# EAGLE design Instrumentation_amplifier_CC3220SF (EAGLE 9.3.1)
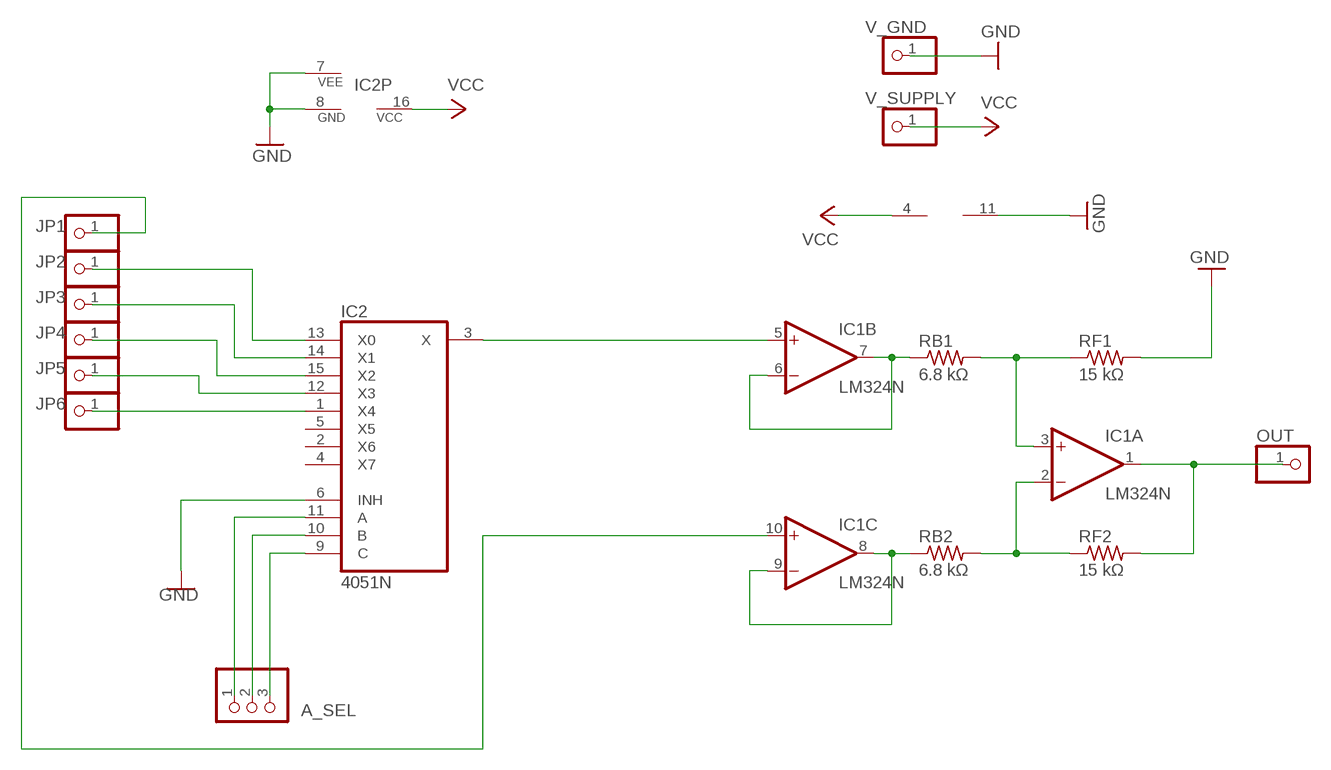
[diagram p0: schematic, sheet 1]

## Parts
A_SEL  PINHD-1X3  [1X03]
IC1  LM324N  [DIL14]
IC2  4051N  [DIL16]
JP1  PINHD-1X1  [1X01]
JP2  PINHD-1X1  [1X01]
JP3  PINHD-1X1  [1X01]
JP4  PINHD-1X1  [1X01]
JP5  PINHD-1X1  [1X01]
JP6  PINHD-1X1  [1X01]
OUT  PINHD-1X1  [1X01]
RB1  6.8 kΩ  R-US_0204/7  [0204/7]
RB2  6.8 kΩ  R-US_0204/7  [0204/7]
RF1  15 kΩ  R-US_0204/7  [0204/7]
RF2  15 kΩ  R-US_0204/7  [0204/7]
V_GND  PINHD-1X1  [1X01]
V_SUPPLY  PINHD-1X1  [1X01]

## Nets
GND: IC1.11(P:V-) IC2.6(INH) IC2.7(VEE) IC2.8(GND) RF1.2 V_GND.1
N$1: IC1.10(C:+IN) JP1.1
N$2: IC1.8(C:OUT) IC1.9(C:-IN) RB2.1
N$3: IC1.2(A:-IN) RB2.2 RF2.1
N$4: IC1.6(B:-IN) IC1.7(B:OUT) RB1.1
N$5: IC1.3(A:+IN) RB1.2 RF1.1
N$6: IC2.13(X0) JP2.1
N$7: IC1.5(B:+IN) IC2.3(X)
N$8: IC2.14(X1) JP3.1
N$9: IC2.15(X2) JP4.1
N$10: IC1.1(A:OUT) OUT.1 RF2.2
N$12: IC2.12(X3) JP5.1
N$13: IC2.1(X4) JP6.1
N$14: A_SEL.1 IC2.11(A)
N$15: A_SEL.2 IC2.10(B)
N$16: A_SEL.3 IC2.9(C)
VCC: IC1.4(P:V+) IC2.16(VCC) V_SUPPLY.1
Unconnected: IC1.12(D:+IN) IC1.13(D:-IN) IC1.14(D:OUT) IC2.2(X6) IC2.4(X7) IC2.5(X5)

## Library data of the parts
A_SEL = pinhead:PINHD-1X3: PIN HEADER
IC1 = linear:LM324: OP AMP
IC2 = 40xx:4051: 8-channel ANALOG MULTIPLEXER
JP1-JP6 OUT V_GND V_SUPPLY = pinhead:PINHD-1X1: PIN HEADER
RB1 RB2 RF1 RF2 = rcl:R-US_: RESISTOR, American symbol; SPICEPREFIX: R

## Board
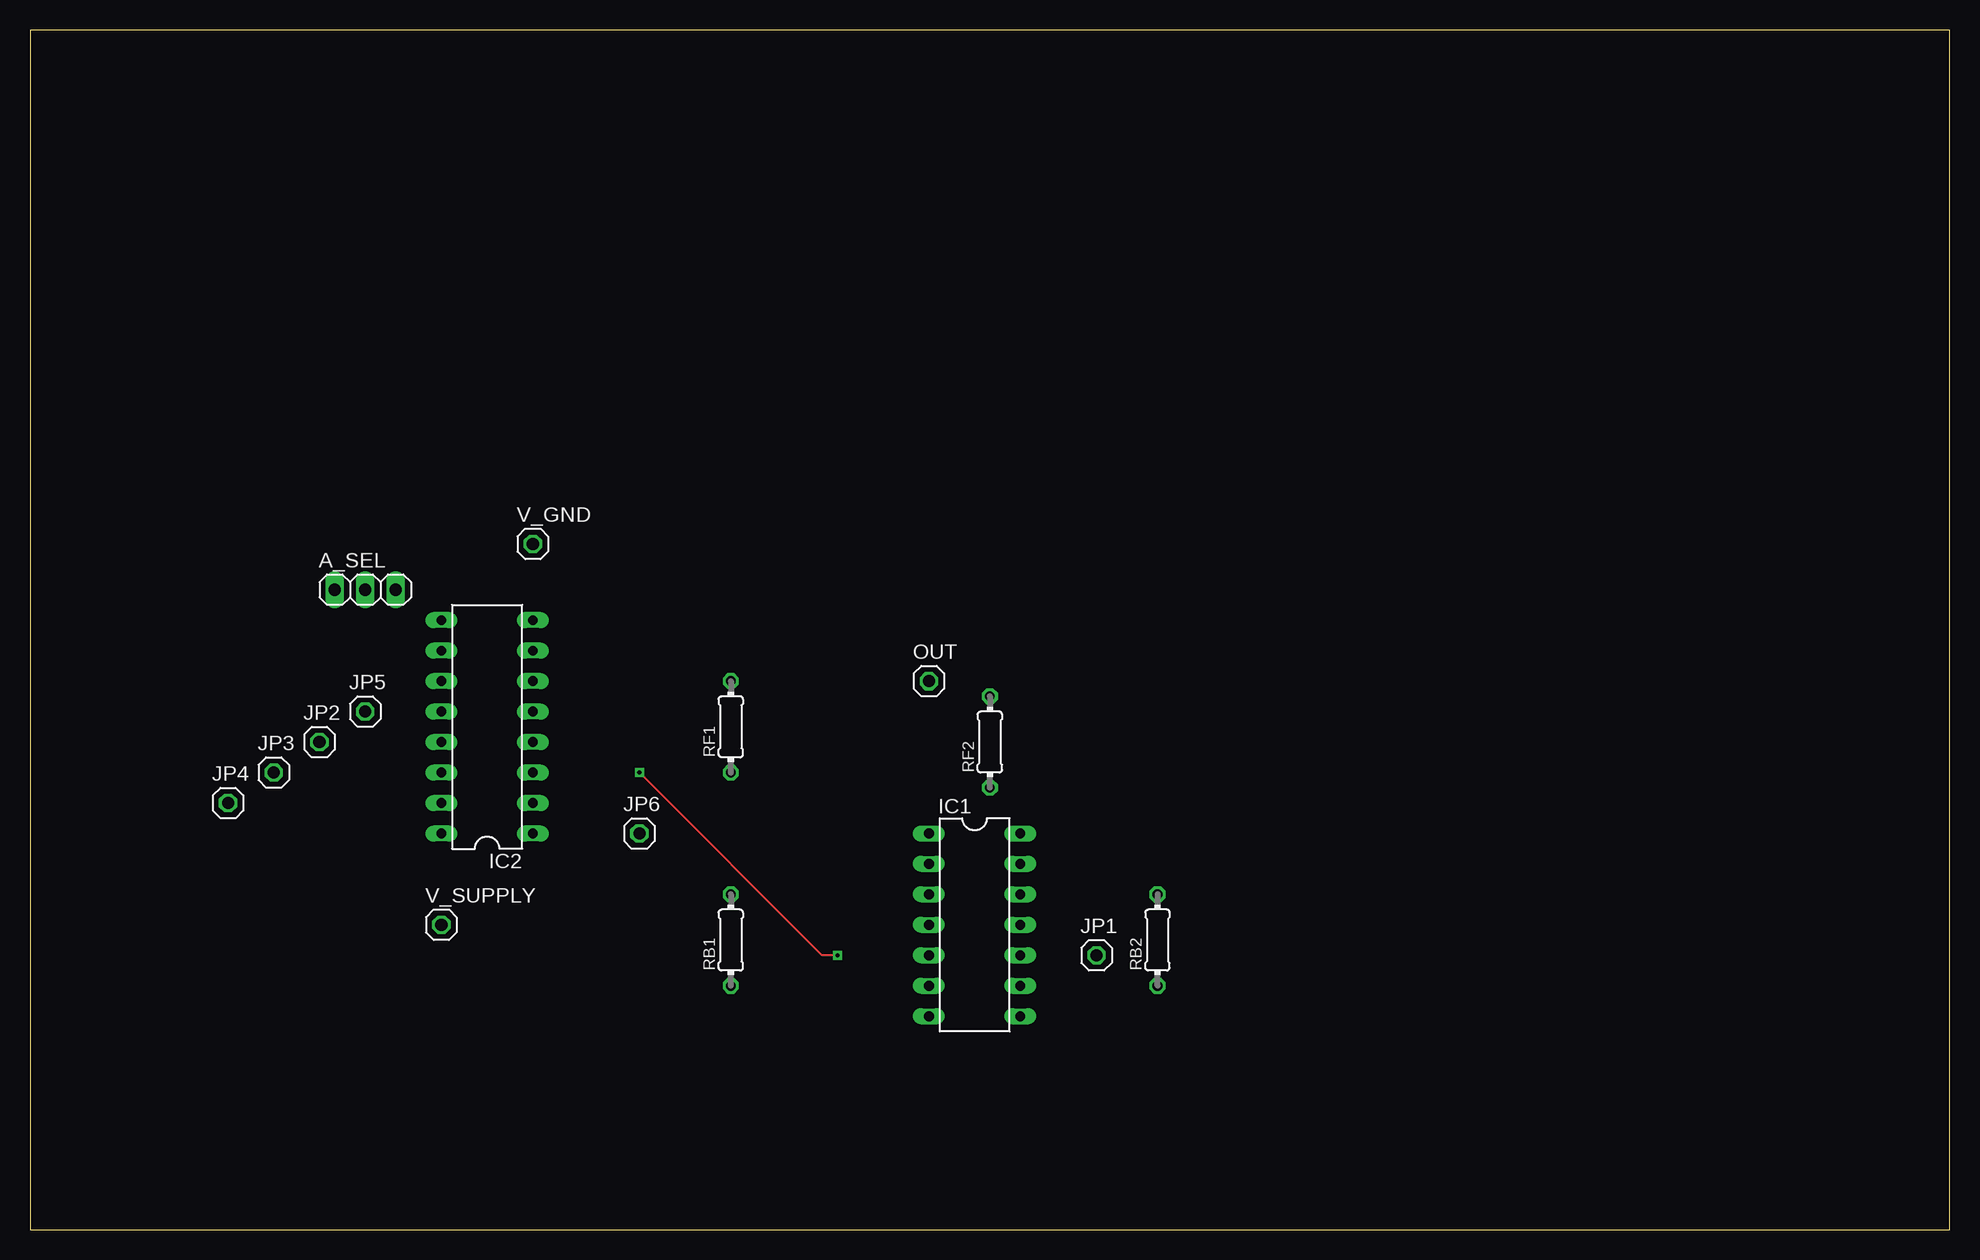
[diagram p1: board, top side]
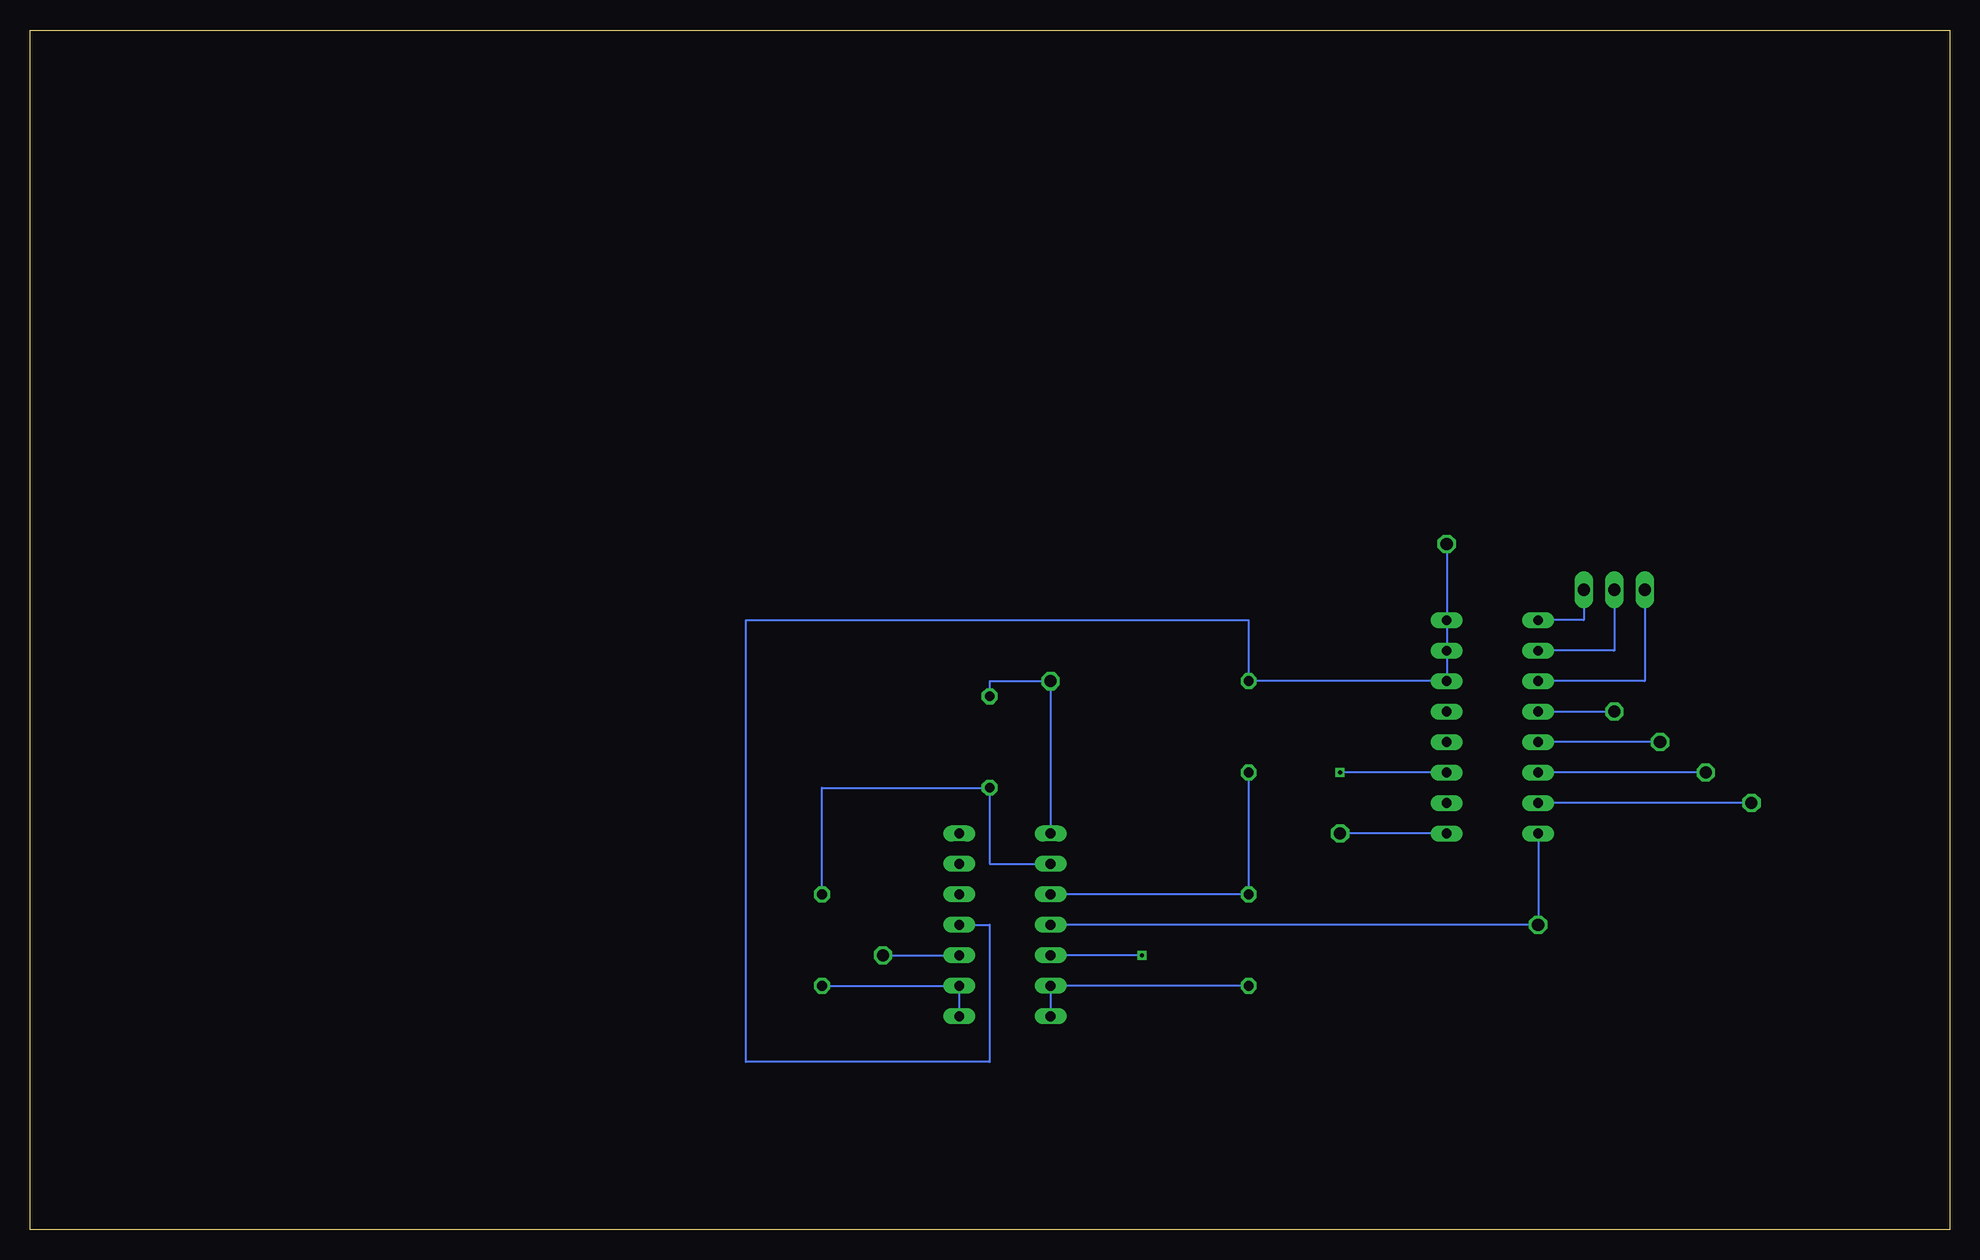
[diagram p2: board, bottom side, seen from below]

Size 160 x 100 mm. Coordinates in mm from the lower left corner, seen from the top.
Outline: 0,0 160,0 160,100 0,100 0,0
Copper layers (1*16): Top 0.035mm / dielectric 1.5mm / Bottom 0.035mm
Design rules "default": minimum track width 6mil, minimum drill 0.35mm, track to track 6mil, track to pad 6mil, pad to pad 6mil, via to via 6mil, smd to smd 6mil, copper to edge 40mil, drill to drill 6mil, minimum pad ring 10mil, minimum via ring 8mil, stop-mask expansion 4mil, vias tented up to drill 0mil, thermal gap 10mil

### Footprints (pad centres in the part's own frame; a part is rotated, then mirrored left to right if it is on the bottom)
1X03 = drill 1.016 long: 1 -2.54,0; 2 0,0; 3 2.54,0
DIL14 = drill 0.813 long: 1 -7.62,-3.81; 2 -5.08,-3.81; 3 -2.54,-3.81; 4 0,-3.81; 5 2.54,-3.81; 6 5.08,-3.81; 7 7.62,-3.81; 8 7.62,3.81; 9 5.08,3.81; 10 2.54,3.81; 11 0,3.81; 12 -2.54,3.81; 13 -5.08,3.81; 14 -7.62,3.81
DIL16 = drill 0.813 long: 1 -8.89,-3.81; 2 -6.35,-3.81; 3 -3.81,-3.81; 4 -1.27,-3.81; 5 1.27,-3.81; 6 3.81,-3.81; 7 6.35,-3.81; 8 8.89,-3.81; 9 8.89,3.81; 10 6.35,3.81; 11 3.81,3.81; 12 1.27,3.81; 13 -1.27,3.81; 14 -3.81,3.81; 15 -6.35,3.81; 16 -8.89,3.81
1X01 = drill 1.016 octagon: 1 0,0
0204/7 = drill 0.813 octagon: 1 -3.81,0; 2 3.81,0

### Placement (x,y rotation side)
A_SEL  27.94,53.34 0 top
IC1  78.74,25.4 270 top
IC2  38.1,41.91 90 top
JP1  88.9,22.86 0 top
JP2  24.13,40.64 0 top
JP3  20.32,38.1 0 top
JP4  16.51,35.56 0 top
JP5  27.94,43.18 0 top
JP6  50.8,33.02 0 top
OUT  74.93,45.72 0 top
RB1  58.42,24.13 90 top
RB2  93.98,24.13 90 top
RF1  58.42,41.91 90 top
RF2  80.01,40.64 90 top
V_GND  41.91,57.15 0 top
V_SUPPLY  34.29,25.4 0 top

### Tracks (layer width: path | path; a pad name or v marks a point on that pad's centre or on a via)
GND
  Bottom 0.152: V_GND.1 IC2.8 IC2.7 IC2.6 RF1.2 58.42,50.8 100.33,50.8 100.33,13.97 80.01,13.97 80.01,25.4 IC1.11
N$1
  Bottom 0.152: JP1.1 IC1.10
N$2
  Bottom 0.152: RB2.1 IC1.9 IC1.8
N$3
  Bottom 0.152: IC1.2 80.01,30.48 RF2.1 93.98,36.83 RB2.2
N$4
  Bottom 0.152: RB1.1 IC1.6 IC1.7
N$5
  Bottom 0.152: RF1.1 RB1.2 IC1.3
N$6
  Bottom 0.152: JP2.1 IC2.13
N$7  (via drill 0.35)
  Top 0.152: v67.31,22.86 66.04,22.86 v50.8,38.1
  Bottom 0.152: IC2.3 v50.8,38.1 | v67.31,22.86 IC1.5
N$8
  Bottom 0.152: JP3.1 IC2.14
N$9
  Bottom 0.152: JP4.1 IC2.15
N$10
  Bottom 0.152: IC1.1 OUT.1 80.01,45.72 RF2.2
N$12
  Bottom 0.152: IC2.12 JP5.1
N$13
  Bottom 0.152: IC2.1 JP6.1
N$14
  Bottom 0.152: A_SEL.1 25.4,45.72 IC2.11
N$15
  Bottom 0.152: A_SEL.2 27.94,48.26 IC2.10
N$16
  Bottom 0.152: A_SEL.3 30.48,50.8 IC2.9
VCC
  Bottom 0.152: IC2.16 V_SUPPLY.1 IC1.4